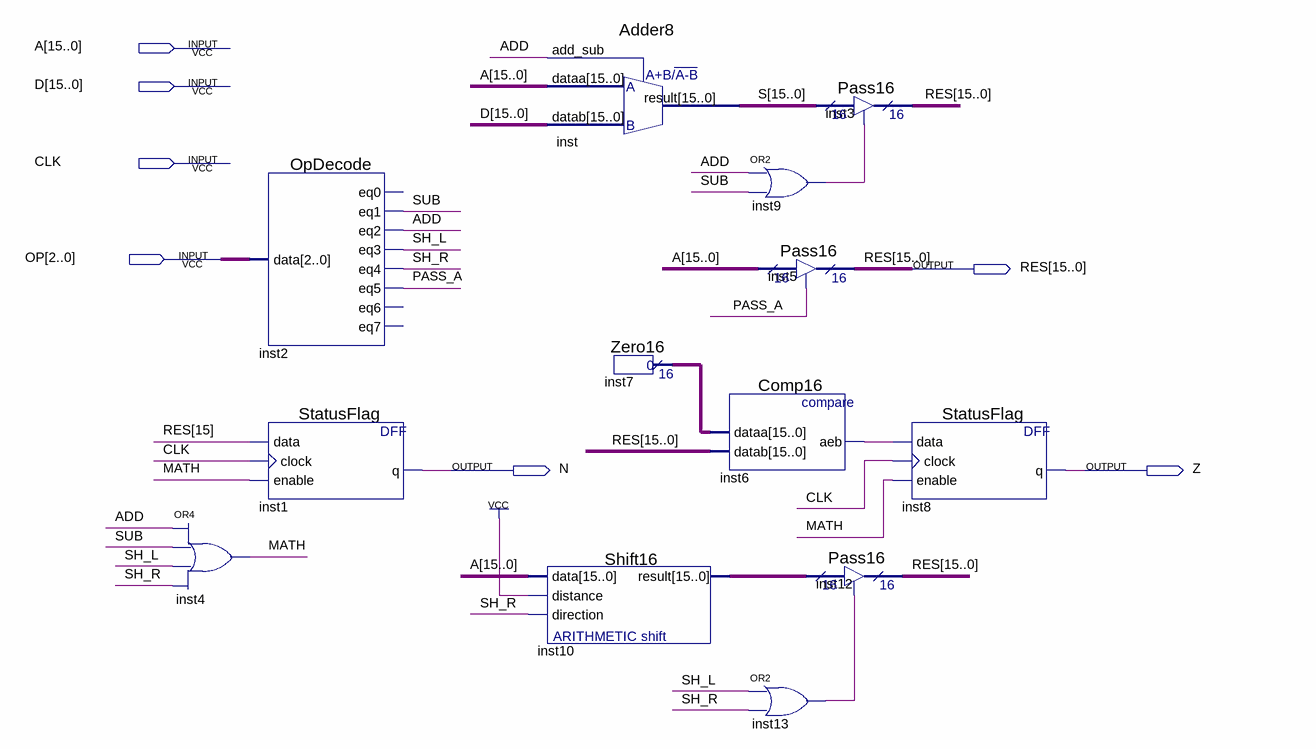
[diagram p0: schematic sheet]
// Quartus schematic ALU.bdf as structural Verilog: 13 symbols, 7 pins
module ALU (
  input  [15:0] A,
  input  [15:0] D,
  input  CLK,
  input  [2:0] OP,
  output [15:0] RES,
  output N,
  output Z
);

  wire ADD, inst6_aeb, inst9_out, inst13_out, MATH, PASS_A, SH_L, SH_R, SUB;
  wire [15:0] inst7_result, inst10_result, S;

  or inst4 (MATH, ADD, SUB, SH_L, SH_R);
  OpDecode inst2 (.data(OP), .eq1(SUB), .eq2(ADD), .eq3(SH_L), .eq4(SH_R), .eq5(PASS_A));  // open: eq0, eq6, eq7
  StatusFlag inst1 (.data(RES[15]), .clock(CLK), .enable(MATH), .q(N));
  Adder8 inst (.dataa(A), .datab(D), .add_sub(ADD), .result(S));
  Shift16 inst10 (.data(A), .distance(1'b1), .direction(SH_R), .result(inst10_result));
  Zero16 inst7 (.result(inst7_result));
  Comp16 inst6 (.dataa(inst7_result), .datab(RES), .aeb(inst6_aeb));
  Pass16 inst3 (.enabledt(inst9_out), .data(S), .tridata(RES));
  or inst9 (inst9_out, ADD, SUB);
  Pass16 inst5 (.enabledt(PASS_A), .data(A), .tridata(RES));
  Pass16 inst12 (.enabledt(inst13_out), .data(inst10_result), .tridata(RES));
  or inst13 (inst13_out, SH_L, SH_R);
  StatusFlag inst8 (.data(inst6_aeb), .clock(CLK), .enable(MATH), .q(Z));
endmodule
